# EAGLE board WheresThePartyAt (EAGLE 5.10)
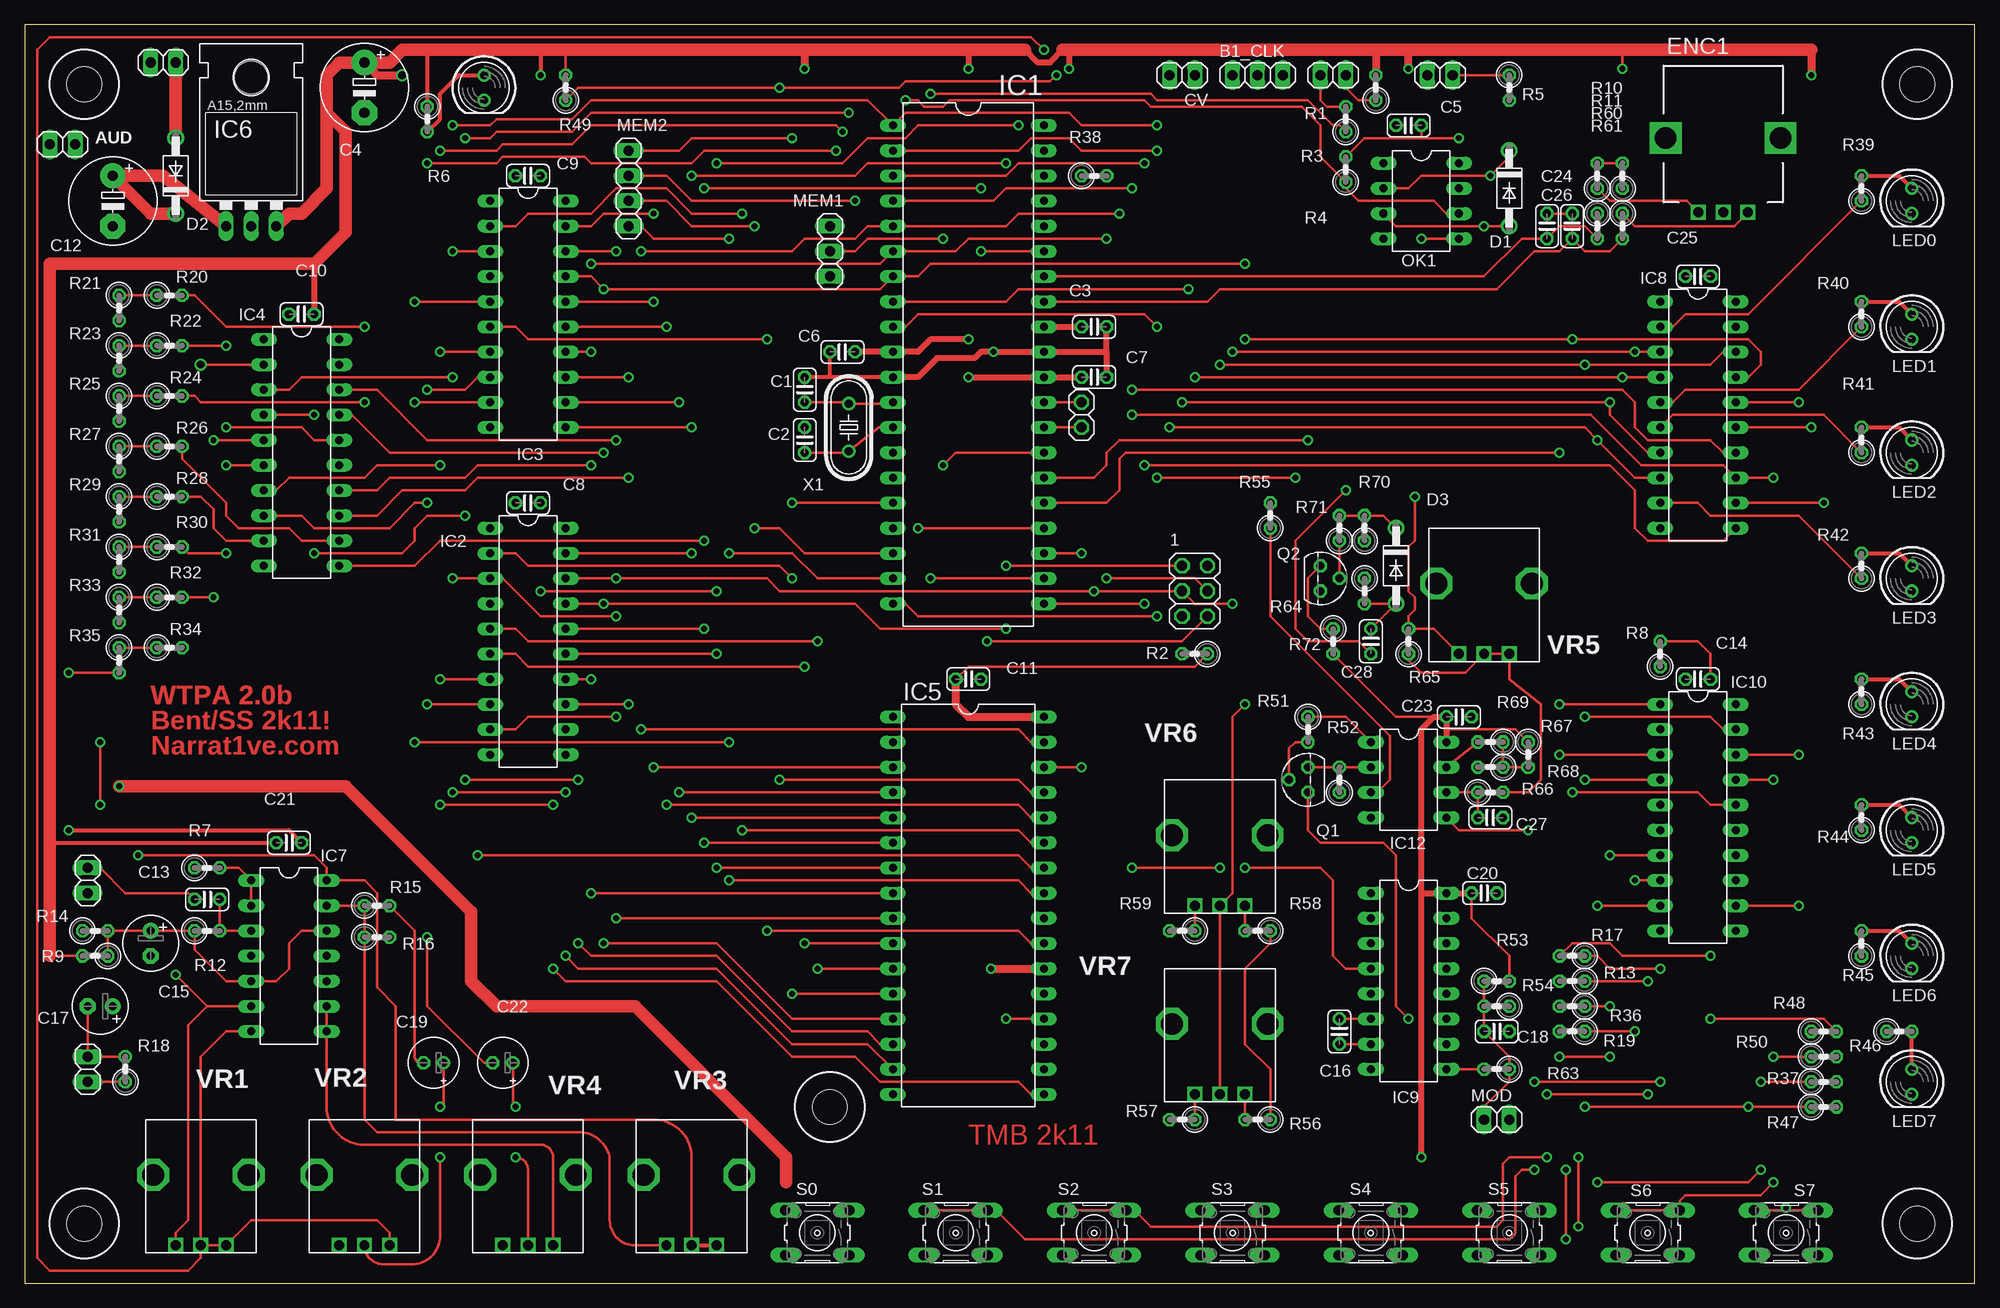
[diagram p4: board, top side]
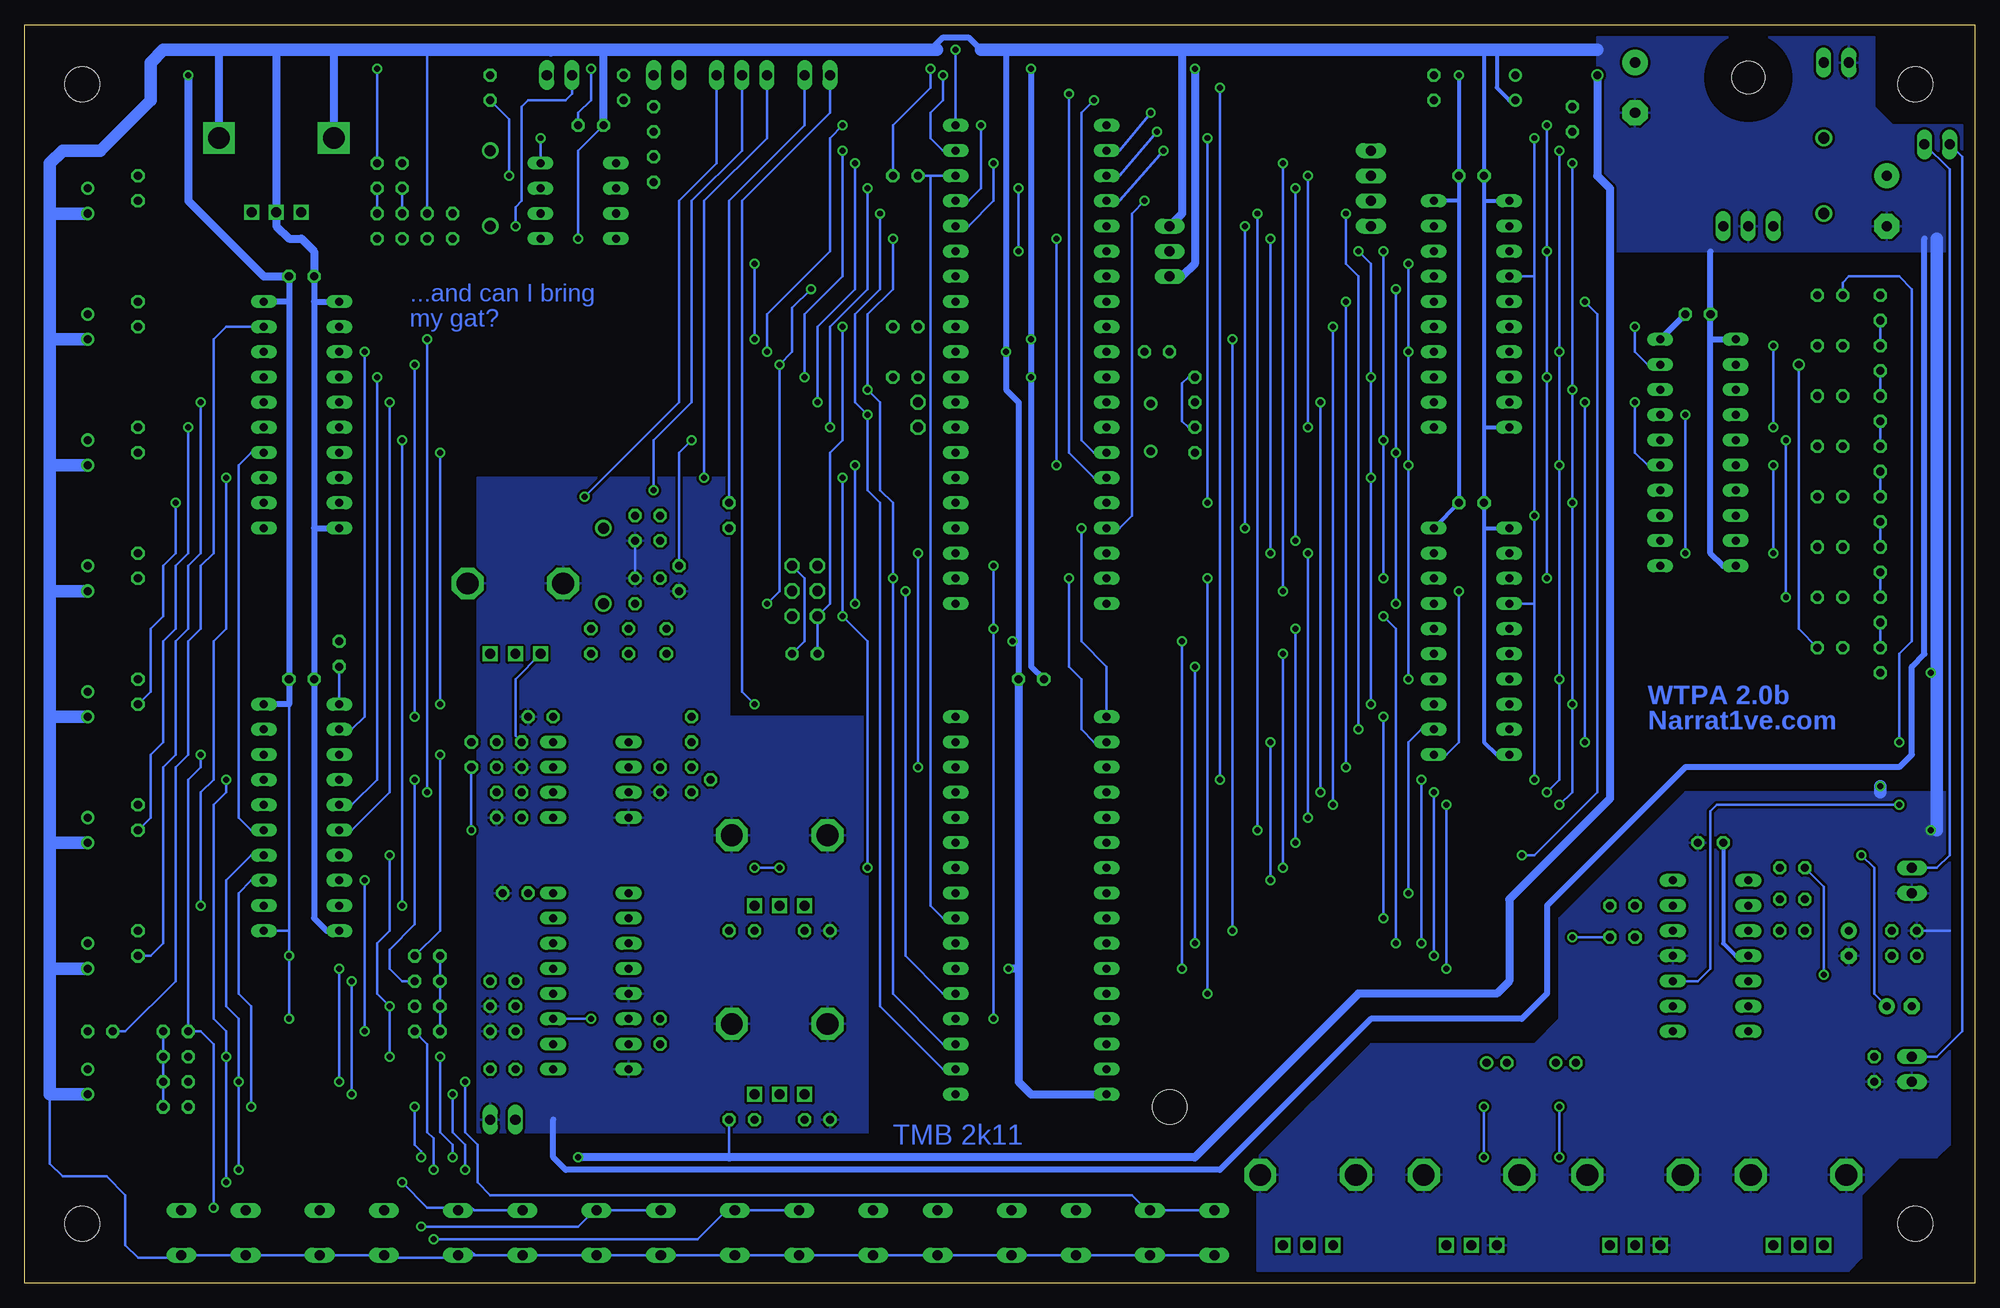
[diagram p5: board, bottom side, seen from below]

Size 196.85 x 127 mm. Coordinates in mm from the lower left corner, seen from the top.
Outline: 0,0 196.85,0 196.85,127 0,127 0,0
Copper layers (1+16): Top 0.035mm / dielectric 1.5mm / Bottom 0.035mm
Design rules "default *": minimum track width 8mil, minimum drill 19mil, track to track 8mil, track to pad 8mil, pad to pad 8mil, via to via 8mil, smd to smd 0mil, copper to edge 20mil, drill to drill 8mil, minimum pad ring 10mil, minimum via ring 8mil, stop-mask expansion 4mil, vias tented up to drill 0mil, thermal gap 10mil

## Footprints (pad centres in the part's own frame; a part is rotated, then mirrored left to right if it is on the bottom)
1X02 = drill 1.016 long: 1 -1.27,0; 2 1.27,0
1X03 = drill 1.016 long: 1 -2.54,0; 2 0,0; 3 2.54,0
C025-024X044 = drill 0.813 octagon: 1 -1.27,0; 2 1.27,0
E5-8,5 = drill 1.016 pad 2.54 round: + -2.54,0 | drill 1.016 pad 2.54 octagon: - 2.54,0
E2,5-6 = drill 0.813 pad 1.6 round: + -1.27,0 | drill 0.813 pad 1.6 octagon: - 1.27,0
E2-5 = drill 0.813 pad 1.27 round: + -1.016,0 | drill 0.813 pad 1.27 octagon: - 1.016,0
DO41-762 = drill 1.118 round: A 3.81,0; C -3.81,0
RE111F_40_ENC = drill 1 square: A -2.5,-7.5; B 2.5,-7.5; COM 0,-7.5 | drill 2.2 square: MNT1 -5.8,0; MNT2 5.8,0
DIL40 = drill 0.813 long: 1 -24.13,-7.62; 2 -21.59,-7.62; 3 -19.05,-7.62; 4 -16.51,-7.62; 5 -13.97,-7.62; 6 -11.43,-7.62; 7 -8.89,-7.62; 8 -6.35,-7.62; 9 -3.81,-7.62; 10 -1.27,-7.62; 11 1.27,-7.62; 12 3.81,-7.62; 13 6.35,-7.62; 14 8.89,-7.62; 15 11.43,-7.62; 16 13.97,-7.62; 17 16.51,-7.62; 18 19.05,-7.62; 19 21.59,-7.62; 20 24.13,-7.62; 21 24.13,7.62; 22 21.59,7.62; 23 19.05,7.62; 24 16.51,7.62; 25 13.97,7.62; 26 11.43,7.62; 27 8.89,7.62; 28 6.35,7.62; 29 3.81,7.62; 30 1.27,7.62; 31 -1.27,7.62; 32 -3.81,7.62; 33 -6.35,7.62; 34 -8.89,7.62; 35 -11.43,7.62; 36 -13.97,7.62; 37 -16.51,7.62; 38 -19.05,7.62; 39 -21.59,7.62; 40 -24.13,7.62
DIL20 = drill 0.813 long: 1 -11.43,-3.81; 2 -8.89,-3.81; 3 -6.35,-3.81; 4 -3.81,-3.81; 5 -1.27,-3.81; 6 1.27,-3.81; 7 3.81,-3.81; 8 6.35,-3.81; 9 8.89,-3.81; 10 11.43,-3.81; 11 11.43,3.81; 12 8.89,3.81; 13 6.35,3.81; 14 3.81,3.81; 15 1.27,3.81; 16 -1.27,3.81; 17 -3.81,3.81; 18 -6.35,3.81; 19 -8.89,3.81; 20 -11.43,3.81
DIL32 = drill 0.813 long: 1 -19.05,-7.62; 2 -16.51,-7.62; 3 -13.97,-7.62; 4 -11.43,-7.62; 5 -8.89,-7.62; 6 -6.35,-7.62; 7 -3.81,-7.62; 8 -1.27,-7.62; 9 1.27,-7.62; 10 3.81,-7.62; 11 6.35,-7.62; 12 8.89,-7.62; 13 11.43,-7.62; 14 13.97,-7.62; 15 16.51,-7.62; 16 19.05,-7.62; 17 19.05,7.62; 18 16.51,7.62; 19 13.97,7.62; 20 11.43,7.62; 21 8.89,7.62; 22 6.35,7.62; 23 3.81,7.62; 24 1.27,7.62; 25 -1.27,7.62; 26 -3.81,7.62; 27 -6.35,7.62; 28 -8.89,7.62; 29 -11.43,7.62; 30 -13.97,7.62; 31 -16.51,7.62; 32 -19.05,7.62
78XXL = drill 1.016 long: GND 0,-3.81; IN -2.54,-3.81; OUT 2.54,-3.81 | hole 3.302: 0,11.176
DIL14 = drill 0.813 long: 1 -7.62,-3.81; 2 -5.08,-3.81; 3 -2.54,-3.81; 4 0,-3.81; 5 2.54,-3.81; 6 5.08,-3.81; 7 7.62,-3.81; 8 7.62,3.81; 9 5.08,3.81; 10 2.54,3.81; 11 0,3.81; 12 -2.54,3.81; 13 -5.08,3.81; 14 -7.62,3.81
DIL16 = drill 0.813 long: 1 -8.89,-3.81; 2 -6.35,-3.81; 3 -3.81,-3.81; 4 -1.27,-3.81; 5 1.27,-3.81; 6 3.81,-3.81; 7 6.35,-3.81; 8 8.89,-3.81; 9 8.89,3.81; 10 6.35,3.81; 11 3.81,3.81; 12 1.27,3.81; 13 -1.27,3.81; 14 -3.81,3.81; 15 -6.35,3.81; 16 -8.89,3.81
DIL08 = drill 0.813 long: 1 -3.81,-3.81; 2 -1.27,-3.81; 3 1.27,-3.81; 4 3.81,-3.81; 5 3.81,3.81; 6 1.27,3.81; 7 -1.27,3.81; 8 -3.81,3.81
1X01 = drill 1.016 octagon: 1 0,0
2X03 = drill 1.016 octagon: 1 -2.54,-1.27; 2 -2.54,1.27; 3 0,-1.27; 4 0,1.27; 5 2.54,-1.27; 6 2.54,1.27
LED5MM = drill 0.813 round: A -1.27,0; K 1.27,0
1X04 = drill 1.016 long: 1 -3.81,0; 2 -1.27,0; 3 1.27,0; 4 3.81,0
TO92 = drill 0.813 octagon: 1 1.27,0; 2 0,1.905; 3 -1.27,0
0207/2V = drill 0.813 octagon: 1 -1.27,0; 2 1.27,0
B3F-10XX = drill 1.016 long: 1 -3.251,2.261; 2 3.251,2.261; 3 -3.251,-2.261; 4 3.251,-2.261
6X32_HOLE = hole 3.5: 0,0
ALPHA_9MM_POT = drill 1 square: P$1 -2.54,-7.62; P$2 0,-7.62; P$3 2.54,-7.62 | drill 2.2 octagon: P$4 -4.826,-0.508; P$5 4.826,-0.508
HC49U-V = drill 0.813 round: 1 -2.413,0; 2 2.413,0

## Placement (x,y rotation side)
AUD  [1X02]  3.81,114.94 180 top
B1_CLK  [1X03]  124.46,121.92 0 top
C1  20pF  [C025-024X044]  78.74,90.17 90 top
C2  20pF  [C025-024X044]  78.74,85.09 90 top
C3  0.1uF  [C025-024X044]  107.95,96.52 0 top
C4  330uF  [E5-8,5]  34.29,120.65 270 top
C5  0.1uF  [C025-024X044]  139.7,116.84 180 top
C6  0.1uF  [C025-024X044]  82.55,93.98 180 top
C7  0.1uF  [C025-024X044]  107.95,91.44 0 top
C8  0.1uF  [C025-024X044]  50.8,78.74 180 top
C9  0.1uF  [C025-024X044]  50.8,111.76 180 top
C10  0.1uF  [C025-024X044]  27.94,97.79 180 top
C11  0.1uF  [C025-024X044]  95.25,60.96 0 top
C12  100uF  [E5-8,5]  8.89,109.22 270 top
C13  0.1uF  [C025-024X044]  18.41,38.73 0 top
C14  0.1uF  [C025-024X044]  168.91,60.96 180 top
C15  10uF  [E2,5-6]  12.7,34.29 270 top
C16  0.1uF  [C025-024X044]  132.72,25.4 90 top
C17  10uF  [E2,5-6]  7.62,27.94 180 top
C18  0.1uF  [C025-024X044]  148.59,25.4 0 top
C19  1.0uF  [E2-5]  41.27,22.23 180 top
C20  0.1uF  [C025-024X044]  147.32,39.37 0 top
C21  0.1uF  [C025-024X044]  26.67,44.45 0 top
C22  1.0uF  [E2-5]  48.26,22.23 180 top
C23  0.1uF  [C025-024X044]  144.78,57.15 0 top
C24  0.1uF  [C025-024X044]  156.21,106.68 90 top
C25  0.1uF  [C025-024X044]  168.91,101.6 180 top
C26  0.1uF  [C025-024X044]  153.67,106.68 90 top
C27  0.1uF  [C025-024X044]  147.96,46.99 180 top
C28  820pF  [C025-024X044]  135.89,64.77 270 top
CV  [1X02]  116.84,121.92 180 top
D1  1N4004  [DO41-762]  149.86,110.49 270 top
D2  1N4004  [DO41-762]  15.24,111.76 90 top
D3  1N4004  [DO41-762]  138.43,72.39 270 top
ENC1  [RE111F_40_ENC]  171.45,115.57 0 top
IC1  ATMEGA644pa  [DIL40]  95.25,92.71 270 top
IC2  74LS373N  [DIL20]  50.8,64.77 270 top
IC3  74LS373N  [DIL20]  50.8,97.79 270 top
IC4  74LS373N  [DIL20]  27.94,83.82 270 top
IC5  AS6C4008  [DIL32]  95.25,38.1 270 top
IC6  [78XXL]  22.86,110.49 0 top
IC7  TLV2474  [DIL14]  26.67,33.02 270 top
IC8  74LS373N  [DIL20]  168.91,87.63 270 top
IC9  4046N  [DIL16]  139.7,30.48 270 top
IC10  74LS373N  [DIL20]  168.91,46.99 270 top
IC12  LM358  [DIL08]  139.7,50.8 270 top
JP1  [1X01]  106.68,88.9 0 top
JP2  [1X01]  106.68,86.36 0 top
JP3  ISP  [2X03]  118.11,69.85 270 top
JP5  DC In  [1X02]  13.97,123.19 0 top
JP6  AudioIn  [1X02]  6.35,40.64 90 top
JP7  AudioOut  [1X02]  6.35,21.59 270 top
JP10  MIDI Out  [1X02]  132.08,121.92 0 top
JP11  MIDI In  [1X02]  142.88,121.92 0 top
LED0  [LED5MM]  190.5,109.22 270 top
LED1  [LED5MM]  190.5,96.52 270 top
LED2  [LED5MM]  190.5,83.82 270 top
LED3  [LED5MM]  190.5,71.12 270 top
LED4  [LED5MM]  190.5,58.42 270 top
LED5  [LED5MM]  190.5,45.72 270 top
LED6  [LED5MM]  190.5,33.02 270 top
LED7  [LED5MM]  190.5,20.32 270 top
MEM1  [1X03]  81.28,104.14 90 top
MEM2  [1X04]  60.96,110.49 90 top
MOD  [1X02]  148.59,16.51 0 top
OK1  6N138  [DIL08]  140.97,109.22 270 top
POWER  [LED5MM]  46.35,120.65 270 top
Q1  BC337  [TO92]  129.54,50.8 90 top
Q2  BC337  [TO92]  130.81,71.12 270 top
R1  220  [0207/2V]  136.4,120.65 90 top
R2  10k  [0207/2V]  118.11,63.5 180 top
R3  220  [0207/2V]  133.35,117.47 90 top
R4  220  [0207/2V]  133.35,112.39 90 top
R5  220  [0207/2V]  149.86,120.65 270 top
R6  220  [0207/2V]  40.64,117.47 270 top
R7  2.2k  [0207/2V]  18.41,41.91 0 top
R8  10k  [0207/2V]  165.1,63.5 90 top
R9  10k  [0207/2V]  7.11,33.02 180 top
R10  10k  [0207/2V]  158.75,111.76 90 top
R11  10k  [0207/2V]  161.29,111.76 90 top
R12  200k  [0207/2V]  18.41,35.56 0 top
R13  10k  [0207/2V]  156.21,30.48 180 top
R14  10k  [0207/2V]  7.11,35.56 0 top
R15  200k  [0207/2V]  35.56,38.1 0 top
R16  200k  [0207/2V]  35.56,34.92 0 top
R17  10k  [0207/2V]  156.21,33.02 180 top
R18  200k  [0207/2V]  10.16,21.59 90 top
R19  10k  [0207/2V]  156.21,25.4 180 top
R20  51k  [0207/2V]  14.61,99.69 0 top
R21  25.5k  [0207/2V]  9.53,98.42 270 top
R22  51k  [0207/2V]  14.61,94.61 0 top
R23  25.5k  [0207/2V]  9.53,93.34 270 top
R24  51k  [0207/2V]  14.61,89.53 0 top
R25  25.5k  [0207/2V]  9.53,88.27 270 top
R26  51k  [0207/2V]  14.61,84.45 0 top
R27  25.5k  [0207/2V]  9.53,83.19 270 top
R28  51k  [0207/2V]  14.61,79.38 0 top
R29  25.5k  [0207/2V]  9.53,78.11 270 top
R30  51k  [0207/2V]  14.61,74.3 0 top
R31  25.5k  [0207/2V]  9.53,73.03 270 top
R32  51k  [0207/2V]  14.61,69.22 0 top
R33  25.5k  [0207/2V]  9.53,67.94 270 top
R34  51k  [0207/2V]  14.61,64.14 0 top
R35  51k  [0207/2V]  9.53,62.87 270 top
R36  10k  [0207/2V]  156.21,27.94 180 top
R37  10k  [0207/2V]  181.61,20.32 0 top
R38  200k  [0207/2V]  107.95,111.76 0 top
R39  470  [0207/2V]  185.42,110.49 90 top
R40  470  [0207/2V]  185.42,97.79 90 top
R41  470  [0207/2V]  185.42,85.09 90 top
R42  470  [0207/2V]  185.42,72.39 90 top
R43  470  [0207/2V]  185.42,59.69 90 top
R44  470  [0207/2V]  185.42,46.99 90 top
R45  470  [0207/2V]  185.42,34.29 90 top
R46  470  [0207/2V]  189.23,25.4 0 top
R47  10k  [0207/2V]  181.61,17.78 0 top
R48  10k  [0207/2V]  181.61,25.4 0 top
R49  200k  [0207/2V]  54.61,120.65 90 top
R50  10k  [0207/2V]  181.61,22.86 0 top
R51  470  [0207/2V]  129.54,55.88 270 top
R52  2.2k  [0207/2V]  132.72,50.8 90 top
R53  10k  [0207/2V]  148.59,30.48 0 top
R54  10k  [0207/2V]  148.59,27.94 180 top
R55  470  [0207/2V]  125.73,77.47 90 top
R56  51k  [0207/2V]  124.46,16.51 180 top
R57  51k  [0207/2V]  116.84,16.51 180 top
R58  14.3k  [0207/2V]  124.46,35.56 180 top
R59  220  [0207/2V]  116.84,35.56 180 top
R60  10k  [0207/2V]  158.75,106.68 270 top
R61  10k  [0207/2V]  161.29,106.68 270 top
R63  10k  [0207/2V]  148.59,21.59 180 top
R64  10k  [0207/2V]  135.25,69.85 270 top
R65  10k  [0207/2V]  139.7,64.77 90 top
R66  220  [0207/2V]  147.96,49.53 0 top
R67  10k  [0207/2V]  151.76,53.34 270 top
R68  10k  [0207/2V]  147.96,52.07 180 top
R69  10k  [0207/2V]  147.96,54.61 180 top
R70  10k  [0207/2V]  135.25,76.2 90 top
R71  470  [0207/2V]  132.72,76.2 90 top
R72  2.2k  [0207/2V]  132.08,64.77 270 top
S0  [B3F-10XX]  80.01,5.08 180 top
S1  [B3F-10XX]  93.98,5.08 180 top
S2  [B3F-10XX]  107.95,5.08 180 top
S3  [B3F-10XX]  121.92,5.08 180 top
S4  [B3F-10XX]  135.89,5.08 180 top
S5  [B3F-10XX]  149.86,5.08 180 top
S6  [B3F-10XX]  163.83,5.08 180 top
S7  [B3F-10XX]  177.8,5.08 180 top
U$1  [6X32_HOLE]  6,6 0 top
U$2  [6X32_HOLE]  191.05,6 0 top
U$3  [6X32_HOLE]  191.05,121 0 top
U$4  [6X32_HOLE]  6,121 0 top
U$5  [6X32_HOLE]  81.28,17.78 0 top
VR1  100kA  [ALPHA_9MM_POT]  17.78,11.43 0 top
VR2  10kA  [ALPHA_9MM_POT]  34.29,11.43 0 top
VR3  100kA  [ALPHA_9MM_POT]  67.31,11.43 0 top
VR4  10kA  [ALPHA_9MM_POT]  50.8,11.43 0 top
VR5  10kA  [ALPHA_9MM_POT]  147.32,71.12 0 top
VR6  10kA  [ALPHA_9MM_POT]  120.65,45.72 0 top
VR7  100kA  [ALPHA_9MM_POT]  120.65,26.67 0 top
X1  [HC49U-V]  83.19,86.36 90 top

## Tracks (layer width: path | path; a pad name or v marks a point on that pad's centre or on a via)
A0  (via drill 0.6)
  Top 0.254: IC2.2 49.53,73.66 50.8,72.39 76.2,72.39 v77.47,71.12 | v77.47,29.21 IC5.12
  Bottom 0.254: v77.47,29.21 v77.47,71.12
A1  (via drill 0.6)
  Top 0.254: IC2.5 49.53,66.04 50.8,64.77 v80.01,64.77 | v80.01,31.75 IC5.11
  Bottom 0.254: v80.01,64.77 80.01,59.69 v80.01,31.75
A2  (via drill 0.6)
  Top 0.254: IC2.6 49.53,63.5 50.8,62.23 v78.74,62.23 | v78.74,34.29 IC5.10
  Bottom 0.254: v78.74,62.23 78.74,58.42 v78.74,34.29
A3  (via drill 0.6)
  Top 0.254: IC2.9 49.53,55.88 50.8,57.15 v59.69,57.15 | v59.69,36.83 IC5.9
  Bottom 0.254: v59.69,36.83 v59.69,57.15
A4  (via drill 0.6)
  Top 0.254: v57.15,39.37 IC5.8
  Bottom 0.254: v57.15,39.37 57.15,54.61 55.88,55.88 IC2.12
A5  (via drill 0.6)
  Top 0.254: v69.85,63.5 IC2.15 | v69.85,41.91 IC5.7
  Bottom 0.254: v69.85,41.91 v69.85,63.5
A6  (via drill 0.6)
  Top 0.254: v68.58,66.04 IC2.16 | v68.58,44.45 IC5.6
  Bottom 0.254: v68.58,44.45 v68.58,66.04
A7  (via drill 0.6)
  Top 0.254: v67.31,73.66 IC2.19 | v67.31,46.99 IC5.5
  Bottom 0.254: v67.31,46.99 v67.31,73.66
A8  (via drill 0.6)
  Top 0.254: IC3.2 49.53,106.68 50.8,107.95 57.15,107.95 59.69,110.49 64.77,110.49 67.31,107.95 v72.39,107.95 | IC5.27 101.6,44.45 100.33,45.72 v72.39,45.72
  Bottom 0.254: v72.39,45.72 v72.39,107.95
A9  (via drill 0.6)
  Top 0.254: IC5.26 101.6,41.91 100.33,43.18 v45.72,43.18 | v39.37,99.06 IC3.5
  Bottom 0.254: v39.37,99.06 38.1,97.79 38.1,49.53 44.45,43.18 v45.72,43.18
A10  (via drill 0.6)
  Top 0.254: IC3.6 49.53,96.52 50.8,95.25 v74.93,95.25 | IC5.23 101.6,34.29 100.33,35.56 v74.93,35.56
  Bottom 0.254: v74.93,35.56 v74.93,95.25
A11  (via drill 0.6)
  Top 0.254: IC5.25 101.6,39.37 100.33,40.64 v71.12,40.64 | v39.37,88.9 IC3.9 | v39.37,54.61 v71.12,54.61
  Bottom 0.254: v71.12,54.61 v71.12,40.64 | v39.37,54.61 v39.37,88.9
A12  (via drill 0.6)
  Top 0.254: v66.04,88.9 IC3.12 | v66.04,49.53 IC5.4
  Bottom 0.254: v66.04,49.53 v66.04,88.9
A13  (via drill 0.6)
  Top 0.254: v64.77,96.52 IC3.15 | IC5.28 101.6,46.99 100.33,48.26 v64.77,48.26
  Bottom 0.254: v64.77,48.26 v64.77,96.52
A14  (via drill 0.6)
  Top 0.254: v63.5,99.06 IC3.16 | v63.5,52.07 IC5.3
  Bottom 0.254: v63.5,52.07 v63.5,99.06
A15  (via drill 0.6)
  Top 0.254: IC3.19 57.15,106.68 58.42,107.95 v63.5,107.95 | IC5.31 101.6,54.61 100.33,55.88 v62.23,55.88
  Bottom 0.254: v62.23,55.88 62.23,101.6 63.5,102.87 v63.5,107.95
A16  (via drill 0.6)
  Top 0.254: v91.44,71.12 IC1.22
  Bottom 0.254: v91.44,71.12 91.44,62.23 90.17,60.96 90.17,55.88 88.9,54.61 IC5.2
A17  (via drill 0.6)
  Top 0.254: v106.68,73.66 IC1.23 | IC5.30 v106.68,52.07
  Bottom 0.254: v106.68,52.07 v106.68,73.66
A18  (via drill 0.6)
  Top 0.254: v90.17,76.2 IC1.24
  Bottom 0.254: v90.17,76.2 90.17,64.77 87.63,62.23 IC5.1
ACLK  (via drill 0.6)
  Top 0.254: IC1.20 88.9,68.58 90.17,67.31 v114.3,67.31 | IC9.4 133.35,31.75 132.08,33.02 132.08,40.64 130.81,41.91 v123.19,41.91 | v111.76,41.91 v120.65,41.91 | v114.3,81.28 v128.27,81.28
  Bottom 0.254: v120.65,41.91 v123.19,41.91 | v111.76,41.91 111.76,64.77 v114.3,67.31 v114.3,81.28 | v128.27,81.28 128.27,109.22 121.92,115.57 B1_CLK.1
AIN0  (via drill 0.6)
  Top 0.254: VR1.P$2 VR1.P$3 22.86,6.35 35.56,6.35 36.83,5.08 VR2.P$3 | VR1.P$2 17.78,22.86 20.32,25.4 IC7.7 | v102.87,124.46 101.6,125.73 2.54,125.73 1.27,124.46 1.27,2.54 2.54,1.27 16.51,1.27 17.78,2.54 VR1.P$2
  Bottom 0.254: v102.87,124.46 IC1.40
AUDIO_IN
  Top 0.254: JP6.2 7.62,41.91 10.16,39.37 16.51,39.37 C13.1
  Bottom 0.254: JP6.2 3.81,41.91 2.54,43.18 2.54,112.39 AUD.1
AUDIO_OUT
  Top 0.254: R18.2 JP7.1 C17.-
  Bottom 0.254: AUD.2 1.27,113.67 1.27,25.4 3.81,22.86 JP7.1
BCLK  (via drill 0.6)
  Top 0.254: Q2.3 129.54,71.12 129.54,67.31 130.81,66.04 R72.1 | IC1.26 107.95,81.28 109.22,82.55 109.22,83.82 110.49,85.09 v129.54,85.09
  Bottom 0.254: v129.54,85.09 130.81,83.82 Q2.3
CV_IN
  Top 0.254: R55.1 125.73,67.31 137.79,55.24 137.79,50.8 136.53,49.53 IC12.3
CV_KNOB  (via drill 0.6)
  Top 0.254: VR7.P$2 VR6.P$2 121.92,39.37 121.92,57.15 v123.19,58.42
  Bottom 0.254: CV.2 115.57,118.11 124.46,109.22 124.46,59.69 v123.19,58.42
DAC
  Top 0.254: IC7.9 IC7.8 30.48,17.78 arc90 34.29,13.97 52.07,13.97 arc-90 53.34,12.7 VR4.P$3
DAC0  (via drill 0.8)
  Top 0.254: v17.78,92.71 IC4.2
  Bottom 0.254: v17.78,92.71 17.78,66.04 R34.2
DAC1  (via drill 0.6)
  Top 0.254: v19.05,85.09 IC4.5 | R32.2 v19.05,69.22
  Bottom 0.254: v19.05,69.22 v19.05,85.09
DAC2  (via drill 0.6)
  Top 0.254: v20.32,82.55 IC4.6 | v20.32,73.66 16.51,73.66 R30.2
  Bottom 0.254: v20.32,73.66 v20.32,82.55
DAC3
  Top 0.254: IC4.9 20.32,74.93 19.05,76.2 19.05,78.11 17.78,79.38 R28.2
DAC4
  Top 0.254: R26.2 15.88,83.19 20.32,78.74 20.32,77.47 21.59,76.2 26.67,76.2 27.94,74.93 IC4.12
DAC5  (via drill 0.6)
  Top 0.254: R24.2 17.14,89.53 17.78,88.9 v34.29,88.9
  Bottom 0.254: v34.29,88.9 34.29,83.82 33.02,82.55 IC4.15
DAC6  (via drill 0.6)
  Top 0.254: IC4.16 29.21,85.09 27.94,86.36 v20.32,86.36 | v20.32,94.61 R22.2
  Bottom 0.254: v20.32,86.36 v20.32,94.61
DAC7  (via drill 0.6)
  Top 0.254: R20.2 17.14,99.69 20.32,96.52 v34.29,96.52
  Bottom 0.254: v34.29,96.52 34.29,93.98 33.02,92.71 IC4.19
DAC_O  (via drill 0.6)
  Top 0.254: v40.64,34.92 40.64,27.94 46.35,22.23 C22.-
  Bottom 0.254: v40.64,34.92 R16.2
ENC_A
  Top 0.254: IC1.34 147.32,101.6 151.13,105.41 C26.1 154.94,106.68 157.48,106.68 R60.2
ENC_B
  Top 0.254: IC1.33 119.38,99.06 120.65,100.33 148.59,100.33 152.4,104.14 154.94,104.14 C24.1 157.48,104.14 160.02,104.14 R61.2
GND  (via drill 0.6)
  Top 0.254: v4.45,61.59 R35.2 | JP7.2 R18.1 | v140.97,105.41 OK1.5 | C24.2 C26.2 | JP3.6 116.84,64.77 v97.16,64.77
  Top 0.406: IC1.11 81.28,91.44 | 81.28,91.44 C1.2 | 81.28,91.44 C6.2 | v4.45,45.72 26.67,45.72 C21.2
  Top 0.61: 109.22,93.98 IC1.31 v97.79,93.98 96.52,93.98 95.89,93.34 92.08,93.34 90.17,91.44 IC1.11 | 109.22,93.98 C3.2 | 109.22,93.98 C7.2
  Top 0.813: v97.54,31.75 IC5.22
  Top 1.27: v9.53,50.16 32.38,50.16 45.09,37.47 45.09,30.48 47.62,27.94 61.59,27.94 76.83,12.7 76.83,10.16
  Bottom 0.254: 3.81,61.59 v4.45,61.59 | S0.2 82.91,2.82 83.19,2.54 83.26,2.62 S0.1 S1.2 S1.1 104.5,2.82 104.7,2.62 | 104.7,2.62 104.78,2.54 | 104.7,2.62 S2.2 110.85,2.82 111.12,2.54 111.2,2.62 S2.1 118.47,2.82 118.67,2.62 | 118.67,2.62 118.75,2.54 | 118.67,2.62 S3.2 124.82,2.82 125.09,2.54 125.17,2.62 S3.1 132.44,2.82 132.64,2.62 | 145.34,2.62 145.41,2.54 | 145.34,2.62 S5.2 151.41,2.82 | 145.34,2.62 145.14,2.82 S4.1 139.14,2.62 139.06,2.54 138.79,2.82 S4.2 132.64,2.62 | 151.41,2.82 151.76,3.17 151.84,3.1 S5.1 151.84,2.62 | 152.04,2.82 152.12,2.82 152.4,2.54 160.02,2.54 160.3,2.82 S6.2 160.58,2.62 160.66,2.54 160.93,2.82 S6.1 174.35,2.82 174.55,2.62 | 194.31,19.05 194.31,12.06 193.04,10.79 188.59,10.79 186.69,8.89 186.69,3.81 185.42,2.54 180.97,2.54 181.05,2.62 S7.1 174.9,2.82 174.62,2.54 174.55,2.62 | 132.64,2.62 132.72,2.54 | 151.84,2.62 151.76,2.54 | 152.04,2.82 151.41,2.82 | 152.04,2.82 151.84,2.62 | 2.54,35.56 R14.1 | C5.2 140.97,114.3 v140.97,105.41 | 174.55,2.62 S7.2 | 165.1,124.46 165.65,124.46 | 177.8,124.46 177.25,124.46 | 156.21,124.46 C24.2 | R64.1 R70.1 | 96.52,64.77 v97.16,64.77 | C2.2 79.38,86.36 80.01,87 80.01,90.81 79.38,91.44 C1.2
  Bottom 0.406: 49.53,109.22 C9.2 49.53,124.46 | 49.53,109.22 49.53,86.36 | 49.53,86.36 C8.2 49.53,76.2 | 49.53,109.22 IC3.1 | 49.53,76.2 IC2.1 | 49.53,86.36 IC3.10 | IC2.10 48.26,53.34 49.53,54.61 49.53,76.2 | POWER.K 46.99,119.38 48.26,120.65 48.26,124.46 | v4.45,45.72 3.81,45.72
  Bottom 0.61: 26.67,95.25 C10.2 26.67,104.14 | 26.67,95.25 IC4.1 | IC4.10 25.4,72.39 26.67,73.66 26.67,95.25 | C25.2 167.64,99.06 | 167.64,99.06 IC8.1 | 167.64,76.2 IC8.10 | 167.64,99.06 167.64,76.2 | 167.64,76.2 C14.2 167.64,36.83 166.37,35.56 IC10.10 | C11.2 96.52,64.77 96.52,88.9 97.79,90.17 v97.79,93.98 97.79,124.46 | 5.08,105.41 5.08,63.5 6.35,62.23 6.35,53.34 7.62,52.07 29.21,52.07 43.18,38.1 43.18,29.21 45.72,26.67 60.96,26.67 76.2,11.43 142.24,11.43 143.51,12.7 143.51,16.51 | 100.33,124.46 101.6,125.73 104.14,125.73 105.41,124.46
  Bottom 0.813: 143.51,124.46 143.76,124.21 | C25.2 167.64,104.14 168.91,105.41 170.18,105.41 171.45,106.68 ENC1.COM 171.45,124.46 | IC5.16 95.25,19.05 96.52,20.32 96.52,31.75 | C11.2 96.52,31.75 | 165.65,124.46 ENC1.MNT1 | 177.25,124.46 ENC1.MNT2 | C5.2 138.43,124.46 | MEM1.3 80.01,107.95 80.01,124.46 | 96.52,31.75 v97.54,31.75
  Bottom 1.27: 100.33,124.46 97.79,124.46 80.01,124.46 49.53,124.46 48.26,124.46 38.1,124.46 | 104.78,124.46 105.41,124.46 138.43,124.46 143.51,124.46 156.21,124.46 165.1,124.46 171.45,124.46 177.8,124.46 182.88,124.46 184.15,123.19 184.15,119.38 189.23,114.3 193.04,114.3 194.31,113.03 194.31,107.95 | 3.81,105.41 3.81,61.59 3.81,45.72 | 194.31,107.95 LED0.K | LED7.K 194.31,19.05 194.31,31.75 | 194.31,107.95 194.31,95.25 | 194.31,95.25 194.31,82.55 | 194.31,82.55 194.31,69.85 | 194.31,69.85 194.31,57.15 | 194.31,57.15 194.31,44.45 | 194.31,44.45 194.31,31.75 | 194.31,95.25 LED1.K | 194.31,82.55 LED2.K | 194.31,69.85 LED3.K | 194.31,57.15 LED4.K | 194.31,44.45 LED5.K | 194.31,31.75 LED6.K | v9.53,50.16 9.53,49.53
  pour Bottom (isolate 0.254): 2.54,49.53 29.21,49.53 41.91,36.83 41.91,26.67 44.45,24.13 60.96,24.13 72.39,12.7 72.39,1.27 12.7,1.27 11.43,2.54 11.43,8.89 7.62,12.7 3.81,12.7 2.54,13.97
  pour Bottom (isolate 0.254): 111.76,57.15 125.73,57.15 125.73,81.28 151.13,81.28 151.13,15.24 111.76,15.24
  pour Bottom (isolate 0.254): 10.16,125.73 10.16,118.75 8.26,116.84 1.27,116.84 1.27,104.14 38.1,104.14 38.1,125.73
LATCH0  (via drill 0.6)
  Top 0.254: v43.18,116.84 46.99,116.84 47.62,117.47 55.24,117.47 57.15,119.38 85.09,119.38 IC1.1 88.9,118.11 105.41,118.11 106.68,116.84 v114.3,116.84 | v43.18,104.14 IC3.3 | v43.18,71.12 IC2.3 48.26,71.12 52.07,67.31 v59.69,67.31 | IC4.3 26.67,90.17 27.94,91.44 v43.18,91.44 | IC8.3 v162.56,93.98 v121.92,93.98 | IC5.13 77.47,26.67 69.85,34.29 v58.42,34.29
  Bottom 0.254: v43.18,116.84 v43.18,104.14 v43.18,91.44 v43.18,71.12 | v114.3,116.84 115.57,115.57 115.57,104.14 121.92,97.79 v121.92,93.98 | v59.69,67.31 58.42,66.04 v58.42,34.29 | IC10.2 163.83,55.88 162.56,57.15 v162.56,93.98
LATCH1  (via drill 0.6)
  Top 0.254: v44.45,115.57 46.99,115.57 47.62,116.2 55.24,116.2 57.15,118.11 v83.19,118.11 | v29.21,87.63 IC4.4 | v29.21,73.66 38.1,73.66 39.37,74.93 39.37,76.2 40.64,77.47 v44.45,77.47 | v114.3,114.3 106.68,114.3 105.41,115.57 101.6,115.57 100.33,114.3 IC1.2 | IC8.4 v161.29,91.44 v118.11,91.44 | IC5.14 86.36,24.13 85.09,25.4 77.47,25.4 69.85,33.02 57.15,33.02 v55.88,34.29 | v44.45,50.8 v55.88,50.8
  Bottom 0.254: IC1.2 86.36,114.3 v83.19,118.11 | v44.45,115.57 44.45,101.6 | 44.45,101.6 IC3.4 | 44.45,68.58 v44.45,77.47 44.45,101.6 | v29.21,73.66 v29.21,87.63 | v114.3,114.3 114.3,101.6 118.11,97.79 v118.11,91.44 | 44.45,68.58 IC2.4 | 44.45,68.58 v44.45,50.8 | IC10.5 163.83,48.26 161.29,50.8 v161.29,91.44 | v55.88,50.8 v55.88,34.29
LATCH2  (via drill 0.6)
  Top 0.254: v41.91,114.3 47.62,114.3 48.26,114.94 55.24,114.94 57.15,116.84 81.92,116.84 v82.55,116.2 | v41.91,93.98 IC3.7 | v41.91,60.96 IC2.7 | IC4.7 25.4,80.01 26.67,81.28 34.29,81.28 35.56,82.55 v41.91,82.55 | v113.03,113.03 100.33,113.03 99.06,111.76 IC1.3 | v116.84,88.9 v160.02,88.9 160.02,87.63 163.83,83.82 IC8.7 | IC5.15 85.09,24.13 77.47,24.13 69.85,31.75 55.88,31.75 v54.61,33.02 | v54.61,49.53 v43.18,49.53
  Bottom 0.254: IC1.3 86.36,111.76 v82.55,116.2 | v41.91,114.3 v41.91,93.98 v41.91,82.55 v41.91,60.96 41.91,50.8 v43.18,49.53 | v113.03,113.03 113.03,100.33 116.84,96.52 v116.84,88.9 | IC10.6 163.83,45.72 160.02,49.53 v160.02,88.9 | v54.61,33.02 v54.61,49.53
LATCH3  (via drill 0.6)
  Top 0.254: v40.64,113.03 47.62,113.03 48.26,113.67 56.52,113.67 57.15,113.03 67.31,113.03 68.58,114.3 v81.92,114.3 | v40.64,90.17 44.45,90.17 45.72,91.44 IC3.8 | v40.64,58.42 IC2.8 | IC4.8 27.94,77.47 29.21,76.2 36.83,76.2 39.37,78.74 v40.64,78.74 | v111.76,110.49 99.06,110.49 97.79,109.22 IC1.4 | v115.57,86.36 157.48,86.36 v158.75,85.09 162.56,81.28 IC8.8 | v158.75,38.1 IC10.9 | IC5.17 101.6,19.05 100.33,20.32 86.36,20.32 83.82,22.86 77.47,22.86 69.85,30.48 54.61,30.48 v53.34,31.75 | v53.34,48.26 v41.91,48.26
  Bottom 0.254: IC1.4 86.36,109.22 v81.92,114.3 | v40.64,113.03 v40.64,90.17 v40.64,78.74 v40.64,58.42 40.64,49.53 v41.91,48.26 | v111.76,110.49 111.76,100.33 115.57,96.52 v115.57,86.36 | v158.75,85.09 v158.75,38.1 | v53.34,31.75 v53.34,48.26
LATCH4  (via drill 0.6)
  Top 0.254: v62.23,104.14 77.47,104.14 78.74,105.41 83.82,105.41 85.09,106.68 IC1.5 99.06,106.68 100.33,107.95 v110.49,107.95 | v60.96,91.44 IC3.13 | v60.96,58.42 IC2.13 | IC4.13 35.56,77.47 38.1,80.01 44.45,80.01 45.72,81.28 v60.96,81.28 | v111.76,87.63 158.12,87.63 163.19,82.55 171.45,82.55 IC8.13 v176.53,81.28 | v179.07,38.1 IC10.12
  Bottom 0.254: v62.23,104.14 60.96,102.87 v60.96,91.44 v60.96,81.28 v60.96,58.42 | v110.49,107.95 110.49,100.33 113.03,97.79 113.03,88.9 v111.76,87.63 111.76,80.01 110.49,78.74 110.49,27.94 104.14,21.59 IC5.18 | v176.53,81.28 176.53,66.04 177.8,64.77 177.8,50.8 179.07,49.53 v179.07,38.1
LATCH5/MOSI  (via drill 0.6)
  Top 0.254: v57.15,93.98 IC3.14 | v57.15,102.87 86.36,102.87 IC1.6 93.98,104.14 95.25,105.41 v109.22,105.41 | v57.15,60.96 IC2.14 | IC4.14 35.56,80.01 36.83,81.28 44.45,81.28 45.72,82.55 v57.15,82.55 | IC8.14 171.45,83.82 170.18,85.09 163.83,85.09 162.56,86.36 162.56,88.9 161.29,90.17 v111.76,90.17 | JP3.4 118.11,71.12 v109.22,71.12
  Bottom 0.254: v57.15,102.87 v57.15,93.98 v57.15,82.55 v57.15,60.96 | v109.22,105.41 109.22,100.33 111.76,97.79 v111.76,90.17 110.49,88.9 110.49,80.01 109.22,78.74 v109.22,71.12 109.22,29.21 104.14,24.13 IC5.19 | IC10.15 173.99,45.72 175.26,46.99 175.26,82.55 173.99,83.82 IC8.14
LATCH6/MISO  (via drill 0.6)
  Top 0.254: IC3.17 57.15,101.6 v58.42,100.33 86.36,100.33 IC1.7 90.17,101.6 91.44,102.87 v123.19,102.87 | IC2.17 v58.42,68.58 83.82,68.58 86.36,66.04 v99.06,66.04 | IC4.17 33.02,87.63 36.83,83.82 v58.42,83.82 | v123.19,95.25 v156.21,95.25 173.99,95.25 175.26,93.98 175.26,92.71 173.99,91.44 IC8.17 | IC10.16 170.18,48.26 168.91,49.53 v156.21,49.53 | v99.06,26.67 IC5.20 | v99.06,72.39 JP3.1
  Bottom 0.254: v58.42,68.58 v58.42,83.82 v58.42,100.33 | v123.19,95.25 v123.19,102.87 | v156.21,95.25 v156.21,49.53 | v99.06,26.67 v99.06,66.04 v99.06,72.39
LATCH7/SCK  (via drill 0.6)
  Top 0.254: v59.69,104.14 IC3.18 | IC2.18 v59.69,71.12 74.93,71.12 76.2,69.85 v107.95,69.85 JP3.3 118.11,68.58 v121.92,68.58 | IC4.18 35.56,90.17 40.64,85.09 v59.69,85.09 | IC8.18 171.45,93.98 170.18,92.71 v157.48,92.71 v120.65,92.71 | IC1.8 99.06,99.06 100.33,100.33 v117.47,100.33 | IC10.19 171.45,55.88 170.18,57.15 v157.48,57.15
  Bottom 0.254: v59.69,71.12 v59.69,85.09 v59.69,104.14 | v117.47,100.33 119.38,98.42 119.38,93.98 v120.65,92.71 120.65,69.85 v121.92,68.58 | v157.48,92.71 v157.48,57.15 | IC5.21 104.14,29.21 107.95,33.02 v107.95,69.85
LATCH_ENABLE0  (via drill 0.6)
  Top 0.254: v52.07,69.85 v69.85,69.85 | v69.85,113.03 82.55,113.03 85.09,115.57 88.9,115.57 90.17,116.84 v100.33,116.84
  Bottom 0.254: IC2.11 53.34,53.34 52.07,54.61 v52.07,69.85 | v69.85,69.85 v69.85,113.03 | v100.33,116.84 100.33,110.49 101.6,109.22 IC1.37
LATCH_ENABLE1  (via drill 0.6)
  Top 0.254: IC3.11 v67.31,86.36 | v67.31,111.76 83.82,111.76 85.09,113.03 v99.06,113.03
  Bottom 0.254: v67.31,86.36 v67.31,111.76 | v99.06,113.03 99.06,109.22 101.6,106.68 IC1.36
LATCH_ENABLE2  (via drill 0.6)
  Top 0.254: IC4.11 39.37,72.39 41.91,74.93 v68.58,74.93 | v68.58,110.49 v96.52,110.49 | v96.52,104.14 IC1.35
  Bottom 0.254: v68.58,74.93 v68.58,110.49 | v96.52,110.49 v96.52,104.14
LATCH_ENABLE3  (via drill 0.6)
  Top 0.254: IC8.11 171.45,74.93 163.83,74.93 162.56,76.2 162.56,80.01 160.02,82.55 v113.03,82.55 | IC1.21 v113.03,68.58
  Bottom 0.254: v113.03,68.58 v113.03,82.55
LATCH_ENABLE4  (via drill 0.6)
  Top 0.254: IC1.25 109.22,78.74 110.49,80.01 110.49,83.19 111.12,83.82 v154.94,83.82 | v154.94,58.42 IC10.1
  Bottom 0.254: v154.94,83.82 v154.94,58.42 | IC10.1 R8.1
LED0
  Top 0.254: IC8.2 166.37,96.52 167.64,97.79 173.99,97.79 R39.1
LED1
  Top 0.254: IC8.5 166.37,88.9 167.64,90.17 179.07,90.17 R40.1
LED2
  Top 0.254: R41.1 181.61,87.63 166.37,87.63 IC8.6
LED3
  Top 0.254: IC8.9 168.91,78.74 170.18,77.47 179.07,77.47 R42.1
LED4  (via drill 0.6)
  Top 0.254: v181.61,78.74 IC8.12
  Bottom 0.254: v181.61,78.74 181.61,73.66 182.88,72.39 182.88,67.31 184.15,66.04 184.15,59.69 R43.1
LED5  (via drill 0.6)
  Top 0.254: v180.34,86.36 IC8.15
  Bottom 0.254: R44.1 184.15,46.99 184.15,53.34 182.88,54.61 182.88,64.77 181.61,66.04 181.61,72.39 180.34,73.66 v180.34,86.36
LED6  (via drill 0.6)
  Top 0.254: IC8.16 v179.07,88.9
  Bottom 0.254: R45.1 184.15,33.02 182.88,34.29 182.88,52.07 181.61,53.34 181.61,64.77 180.34,66.04 180.34,72.39 179.07,73.66 v179.07,88.9
LED7
  Bottom 0.254: R46.1 186.69,25.4 181.61,30.48 181.61,52.07 180.34,53.34 180.34,64.77 179.07,66.04 179.07,72.39 177.8,73.66 177.8,95.25 176.53,96.52 IC8.19
MEM_CD  (via drill 0.6)
  Top 0.254: MEM1.2 83.82,104.14 85.09,105.41 v92.71,105.41 | v92.71,82.55 93.98,83.82 IC1.27
  Bottom 0.254: v92.71,82.55 v92.71,105.41
MEM_CS  (via drill 0.6)
  Top 0.254: MEM2.1 62.23,106.68 63.5,105.41 v71.12,105.41 | IC1.19 80.01,71.12 77.47,73.66 v71.12,73.66
  Bottom 0.254: v71.12,73.66 v71.12,105.41
MEM_SCK  (via drill 0.6)
  Top 0.254: MEM2.2 64.77,109.22 67.31,106.68 v73.66,106.68 | v73.66,76.2 76.2,76.2 78.74,73.66 IC1.18
  Bottom 0.254: v73.66,76.2 v73.66,106.68
MEM_SI  (via drill 0.6)
  Top 0.254: MEM2.3 64.77,111.76 67.31,109.22 v83.82,109.22
  Bottom 0.254: IC1.17 86.36,76.2 85.09,77.47 85.09,107.95 v83.82,109.22
MEM_SO  (via drill 0.6)
  Top 0.254: v77.47,78.74 IC1.16 | MEM2.4 66.04,114.3 67.31,115.57 v77.47,115.57
  Bottom 0.254: v77.47,78.74 v77.47,115.57
N$1
  Top 0.254: IC1.12 87.5,88.77 X1.2 83.06,88.9 C1.1
N$2
  Top 0.254: C2.1 82.55,83.82 X1.1 86.23,86.36 IC1.13
N$3
  Top 1.27: IC6.IN 13.97,111.76 C12.+ 12.7,107.95 D2.C
N$4  (via drill 0.6)
  Top 0.254: Q1.3 129.54,45.72 130.81,44.45 137.16,44.45 138.43,43.18 138.43,27.94 v139.7,26.67
  Bottom 0.254: v139.7,26.67 IC9.11
N$5
  Top 0.254: IC1.29 JP1.1
N$6
  Top 0.254: R56.2 VR7.P$3
N$7
  Top 0.254: R7.2 21.59,41.91 IC7.1 IC7.2
N$8
  Top 0.254: JP11.2 R5.1
N$9  (via drill 0.6)
  Top 0.254: OK1.3 138.43,106.68 v147.32,106.68 D1.A
  Bottom 0.254: v147.32,106.68 147.32,108.58 146.69,109.22 146.69,118.75 146.05,119.38 142.24,119.38 141.6,120.02 JP11.1
N$10  (via drill 0.6)
  Top 0.254: OK1.2 139.7,110.49 140.97,111.76 v147.96,111.76 149.86,113.67 D1.C
  Bottom 0.254: R5.2 147.96,117.47 v147.96,111.76
N$11
  Top 0.254: C16.2 IC9.6
N$12
  Top 0.254: R3.2 131.44,118.75 130.81,119.38 JP10.1
N$13
  Top 0.254: JP10.2 133.35,120.65 134.62,119.38 R1.1
N$14
  Top 0.254: R57.1 VR7.P$1
N$15
  Top 1.27: D2.A JP5.2
N$16
  Top 0.254: C16.1 IC9.7
N$17
  Top 0.254: R51.2 128.27,54.61 127.64,53.98 Q1.2
N$18
  Top 0.254: R64.2 D3.A C28.1
N$19
  Top 0.254: R58.2 VR6.P$3
N$20
  Top 0.254: R59.1 VR6.P$1
N$21
  Top 0.254: D3.C 137.16,77.47 R70.2 R71.2
N$22
  Top 0.254: Q1.1 R52.2 IC12.2
N$23
  Top 0.254: Q2.2 R71.1
N$24
  Top 0.254: R51.1 133.35,57.15 IC12.1
N$25
  Top 0.254: IC1.28 JP2.1
N$26
  Top 0.254: MOD.1 147.32,17.78 149.86,20.32 R63.1 149.86,22.86 C18.1 R54.2 R53.1
N$27  (via drill 0.6)
  Top 0.254: v41.91,12.7 41.91,5.08 arc-90 39.37,1.91 36.2,1.91 arc-90 VR2.P$2 | C19.+ 42.29,18.16 arc-90 v41.91,17.78
  Bottom 0.254: v41.91,12.7 v41.91,17.78
N$28
  Bottom 0.254: R55.2 125.73,109.22 118.11,116.84 CV.1
N$29
  Top 0.254: IC9.9 R63.2
N$34  (via drill 0.6)
  Top 0.254: v49.53,12.7 arc-90 50.8,11.43 VR4.P$2 | C22.+ 49.28,18.03 arc90 v49.53,17.78
  Bottom 0.254: v49.53,12.7 v49.53,17.78
N$35
  Top 0.254: ENC1.B 172.56,106.68 162.56,106.68 R61.1
  Bottom 0.254: R61.1 R11.1
N$36
  Top 0.254: R23.1 R22.1
  Bottom 0.254: R23.1 R21.2
N$37
  Top 0.254: ENC1.A 167.8,109.22 160.02,109.22 R10.1
  Bottom 0.254: R60.1 R10.1
N$38
  Top 0.254: C27.2 R66.1 IC12.6
N$39
  Top 0.254: R25.1 R24.1
  Bottom 0.254: R25.1 R23.2
N$40
  Top 0.254: R27.1 R26.1
  Bottom 0.254: R27.1 R25.2
N$41
  Top 0.254: R29.1 R28.1
  Bottom 0.254: R29.1 R27.2
N$42
  Top 0.254: R31.1 R30.1
  Bottom 0.254: R31.1 R29.2
N$43
  Top 0.254: R33.1 R32.1
  Bottom 0.254: R33.1 R31.2
N$44
  Top 0.254: R35.1 R34.1
  Bottom 0.254: R35.1 R33.2
N$45  (via drill 0.6)
  Top 0.254: R20.1 R21.1 | v7.62,48.26 v7.62,54.61
  Bottom 0.254: R20.1 13.34,100.97 12.7,101.6 7.62,101.6 6.35,100.33 6.35,64.77 7.62,63.5 v7.62,54.61 | IC7.10 27.94,30.48 26.67,31.75 26.67,47.62 26.04,48.26 v7.62,48.26
N$46  (via drill 0.6)
  Top 0.254: v11.43,43.18 29.21,43.18 30.48,41.91 IC7.14 34.29,40.64 35.56,39.37 35.56,29.84 37.47,27.94 37.47,16.51 63.5,16.51 arc-90 67.31,12.7 VR3.P$2
  Top 0.406: VR3.P$2 VR3.P$3
  Bottom 0.254: C17.+ 10.16,29.21 10.16,41.91 v11.43,43.18
N$47
  Top 0.406: R6.2 41.91,117.47 41.91,120.02 43.81,121.92 POWER.A
N$48  (via drill 0.6)
  Top 0.254: R67.2 R68.1 R69.1 | v151.76,45.72 144.78,45.72 IC12.5
  Bottom 0.254: v151.76,45.72 R67.2
N$50
  Top 0.254: IC7.3 R12.2 C13.2
N$51
  Top 0.254: R66.2 151.76,49.53 153.03,50.8 153.03,58.42 149.86,60.96 VR5.P$3 VR5.P$2 145.41,61.59 140.97,61.59 139.7,62.87 R65.1
N$55  (via drill 0.6)
  Top 0.254: 18.41,27.94 v15.24,31.11 | VR1.P$1 15.24,5.08 16.51,6.35 16.51,26.04 18.41,27.94 | 18.41,27.94 IC7.6
  Bottom 0.254: v15.24,31.11 15.24,40.01 R7.1
N$60
  Top 0.254: IC7.13 R15.1 R16.1 34.29,16.51 35.56,15.24 55.88,15.24 arc-77 59.05,12.7 59.05,6.35 arc90 61.59,3.81 VR3.P$1
N$68
  Top 0.406: R39.2 189.23,111.76 LED0.A
N$70
  Top 0.406: R40.2 189.23,99.06 LED1.A
N$71
  Top 0.406: R41.2 189.23,86.36 LED2.A
N$72
  Top 0.406: R42.2 189.23,73.66 LED3.A
N$73
  Top 0.406: R43.2 189.23,60.96 LED4.A
N$74
  Top 0.406: R44.2 189.23,48.26 LED5.A
N$75
  Top 0.406: R45.2 189.23,35.56 LED6.A
N$76
  Top 0.406: LED7.A R46.2
N$87
  Top 0.61: IC1.32 C3.1
OE
  Bottom 0.254: 105.41,111.76 IC1.38 | 105.41,111.76 R38.1 | IC5.24 104.14,36.83 105.41,38.1 105.41,111.76
RC  (via drill 0.6)
  Top 0.254: IC12.7 R69.2 | VR5.P$1 142.24,66.04 R65.2 139.7,67.31 140.34,67.94 140.34,69.22 139.7,69.85 139.7,74.3 140.34,74.93 v140.34,79.38
  Bottom 0.254: R69.2 147.32,55.24 147.32,60.96 VR5.P$1 | B1_CLK.3 127,113.03 130.81,109.22 130.81,88.9 v140.34,79.38
RESET  (via drill 0.6)
  Top 0.254: IC1.9 88.9,96.52 90.17,97.79 113.03,97.79 v114.3,96.52
  Bottom 0.254: R2.2 JP3.5 115.57,68.58 115.57,83.82 114.3,85.09 v114.3,96.52
RX0  (via drill 0.6)
  Top 0.254: OK1.6 143.51,107.95 142.24,109.22 134.62,109.22 133.35,110.49 R4.1 130.81,113.67 130.81,116.84 128.91,118.75 113.67,118.75 113.03,119.38 93.34,119.38 92.71,118.75 90.81,118.75 90.17,119.38 v88.9,119.38
  Bottom 0.254: IC1.14 88.9,83.82 90.17,85.09 90.17,118.11 v88.9,119.38
SW0  (via drill 0.6)
  Top 0.254: v154.94,53.34 IC10.3 | v152.4,20.32 v165.1,20.32 | v165.1,31.75 160.02,31.75 158.75,33.02 R17.1
  Bottom 0.254: S0.4 82.91,7.34 83.19,7.62 83.26,7.54 S0.3 83.54,7.34 85.09,8.89 149.86,8.89 151.13,10.16 151.13,13.97 152.4,15.24 v152.4,20.32 | v154.94,53.34 154.94,35.56 R17.1 | v165.1,20.32 v165.1,31.75
SW1  (via drill 0.6)
  Top 0.254: S1.3 98.5,6.91 100.97,4.45 149.86,4.45 150.5,5.08 150.5,10.79 151.13,11.43 v152.4,11.43 | S1.3 97.87,7.06 97.16,6.99 96.8,7.34 | 96.8,7.34 S1.3 | S1.4 96.8,7.34 | v157.48,50.8 IC10.4 | v163.83,30.48 R13.1 | v153.67,19.05 v163.83,19.05
  Bottom 0.254: v152.4,11.43 152.4,13.97 153.67,15.24 v153.67,19.05 | v157.48,50.8 157.48,36.2 160.02,33.66 160.02,31.75 158.75,30.48 R13.1 | v163.83,19.05 v163.83,30.48
SW2  (via drill 0.6)
  Top 0.254: v153.67,12.7 149.86,12.7 149.22,12.06 149.22,6.35 148.59,5.71 113.67,5.71 112.04,7.34 S2.3 111.2,7.06 111.12,6.99 110.77,7.34 S2.4 | v160.02,43.18 IC10.7 | v160.02,27.94 R36.1 | v154.94,22.86 v160.02,22.86
  Bottom 0.254: v153.67,12.7 153.67,13.97 154.94,15.24 v154.94,22.86 | v160.02,43.18 160.02,35.56 161.29,34.29 161.29,29.21 v160.02,27.94 v160.02,22.86
SW3  (via drill 0.6)
  Top 0.254: v155.57,4.45 v155.57,11.43 | R19.1 v162.56,25.4 | v162.56,40.64 IC10.8
  Bottom 0.254: v155.57,4.45 128.91,4.45 126.01,7.34 S3.3 125.17,7.06 125.09,6.99 124.74,7.34 S3.4 | v155.57,11.43 155.57,14.61 156.21,15.24 156.21,24.13 R19.1 | v162.56,25.4 v162.56,40.64
SW4  (via drill 0.6)
  Top 0.254: v156.84,5.71 v156.84,12.7 | R47.1 v173.99,17.78 v157.48,17.78
  Bottom 0.254: v156.84,12.7 156.84,13.34 157.48,13.97 v157.48,17.78 | v156.84,5.71 140.97,5.71 139.34,7.34 S4.3 139.14,7.06 139.06,6.99 138.71,7.34 S4.4 | v173.99,17.78 173.99,27.94 175.26,29.21 175.26,39.37 173.99,40.64 IC10.13
SW5  (via drill 0.6)
  Top 0.254: v175.26,20.32 R37.1 | v158.75,10.16 173.99,10.16 v175.26,11.43
  Bottom 0.254: S5.4 151.49,7.34 151.76,7.62 151.84,7.54 S5.3 153.31,7.34 153.67,7.62 156.21,7.62 v158.75,10.16 | IC10.14 173.99,43.18 176.53,40.64 176.53,27.94 175.26,26.67 v175.26,20.32 v175.26,11.43
SW6  (via drill 0.6)
  Top 0.254: v176.53,22.86 R50.1 | v176.53,50.8 IC10.17 | S6.4 166.65,7.34 167,6.99 167.08,7.06 S6.3 167.08,8.33 167.64,8.89 175.26,8.89 v176.53,10.16
  Bottom 0.254: v176.53,50.8 176.53,49.53 177.8,48.26 177.8,26.67 176.53,25.4 v176.53,22.86 v176.53,10.16
SW7  (via drill 0.6)
  Top 0.254: v179.07,53.34 IC10.18 | S7.4 180.62,7.34 180.97,6.99 181.05,7.06 S7.3 178.08,7.34 v177.8,7.62
  Bottom 0.254: v179.07,53.34 179.07,52.07 180.34,50.8 R48.1 179.07,25.4 177.8,24.13 v177.8,7.62
THRU
  Top 0.254: R15.2 39.37,35.56 39.37,22.86 arc90 40.01,22.23 C19.-
TO_PULSE  (via drill 0.6)
  Top 0.254: C28.2 134.62,64.77 129.54,64.77 128.27,66.04 128.27,74.93 v133.35,80.01
  Bottom 0.254: B1_CLK.2 124.46,114.3 129.54,109.22 129.54,88.9 133.35,85.09 v133.35,80.01
TX0  (via drill 0.6)
  Top 0.254: v91.44,120.02 113.67,120.02 114.3,119.38 129.54,119.38 132.08,116.84 132.72,116.84 R3.1
  Bottom 0.254: IC1.15 88.9,81.28 91.44,83.82 v91.44,120.02
V+  (via drill 0.6, 0.8)
  Top 0.254: 2.54,33.02 R9.2 | 54.61,124.46 R49.2 | 140.97,115.57 135.25,115.57 R4.2 | 140.97,115.57 v144.78,115.57 | 140.97,115.57 C5.1 | v170.18,33.02 161.29,33.02 160.02,34.29 156.21,34.29 R17.2 | v170.18,26.67 181.61,26.67 R48.2 | R58.1 125.73,34.29 123.19,31.75 123.19,24.13 125.73,21.59 R56.1 | R53.2 149.86,33.02 146.05,36.83 C20.1 | R8.2 168.91,64.77 170.18,63.5 C14.1 | 161.29,124.46 v161.29,122.56 | R11.2 R10.2 | R67.1 150.5,55.88 143.51,55.88 | R72.2 138.43,57.15 C23.1 | R2.1 118.11,62.23 95.25,62.23 C11.1
  Top 0.406: 52.07,124.46 v52.07,121.92 | 2.54,44.45 C21.1 | 40.64,124.46 R6.1
  Top 0.61: C6.1 IC1.10 90.17,93.98 91.44,95.25 v95.25,95.25 | C7.1 IC1.30 v95.25,91.44 | 29.21,102.87 C10.1 | C20.1 IC9.16 140.97,39.37 | v140.97,12.7 140.97,39.37 | 140.97,39.37 140.97,55.88 142.24,57.15 C23.1 143.51,55.88 IC12.8 | 104.78,124.46 103.5,123.19 102.23,123.19 100.97,124.46 | 95.25,124.46 v95.25,122.56 | 105.41,124.46 v105.41,122.56
  Top 0.813: 180.34,124.46 v180.34,121.92 | IC5.32 95.25,57.15 93.98,58.42 C11.1 | R1.2 136.4,124.33 136.53,124.46 | v139.7,122.56 139.7,124.46 | v38.1,121.92 35.56,121.92 C4.+ | 78.74,124.46 v78.74,122.56
  Top 1.27: 180.34,124.46 161.29,124.46 139.7,124.46 136.53,124.46 105.41,124.46 104.78,124.46 | 100.97,124.46 95.25,124.46 78.74,124.46 54.61,124.46 52.07,124.46 40.64,124.46 38.1,124.46 36.83,123.19 C4.+ 31.75,123.19 30.48,121.92 30.48,118.11 | 2.54,33.02 2.54,44.45 2.54,102.87 29.21,102.87 32.38,106.05 32.38,116.2 30.48,118.11 | IC6.OUT 26.67,107.95 27.94,107.95 30.48,110.49 30.48,118.11
  Bottom 0.254: C5.1 140.97,118.11 139.7,119.38 v139.7,122.56 | v144.78,115.57 OK1.8 | R17.2 R13.2 R36.2 R19.2 | R48.2 R50.2 R37.2 R47.2 | 170.18,58.42 170.18,35.56 | 170.18,35.56 v170.18,33.02 v170.18,26.67 | R38.2 109.22,116.84 105.41,120.65 v105.41,122.56 | 125.73,12.7 R56.1 | 170.18,35.56 IC10.11 | v161.29,122.56 R11.2 | JP3.2 118.11,71.12 118.11,64.77 R2.1
  Bottom 0.406: 52.07,109.22 C9.1 v52.07,121.92 | 52.07,109.22 C8.1 IC2.20 | 52.07,109.22 IC3.20 | C21.1 25.4,34.29 24.13,33.02 IC7.4
  Bottom 0.61: C10.1 IC4.20 | v95.25,122.56 v95.25,95.25 v95.25,91.44 95.25,62.23 C11.1 | C25.1 170.18,99.06 | 170.18,99.06 IC8.20 | 170.18,99.06 C14.1 170.18,58.42 IC10.20
  Bottom 0.813: v140.97,12.7 125.73,12.7 78.74,12.7 62.23,29.21 48.26,29.21 46.99,30.48 46.99,38.73 36.83,48.9 36.83,110.49 38.1,111.76 v38.1,121.92 | C25.1 172.72,101.6 180.34,109.22 v180.34,121.92 | MEM1.1 80.01,101.6 78.74,102.87 v78.74,122.56
VDD/2A
  Top 0.254: R9.1 R14.2 C15.+ R12.1 17.14,33.66 20.32,30.48 IC7.5 25.4,30.48 26.67,31.75 26.67,34.29 27.94,35.56 IC7.12
WE  (via drill 0.6)
  Top 0.254: v104.14,121.92 103.5,121.28 88.9,121.28 88.27,120.65 v76.2,120.65 55.88,120.65 R49.1 | IC5.29 101.6,49.53 100.33,50.8 v76.2,50.8
  Bottom 0.254: v76.2,50.8 v76.2,120.65 | IC1.39 104.14,114.3 105.41,115.57 105.41,118.11 104.14,119.38 v104.14,121.92

## Text on the board
Top: WTPA 2.0 | WTPA 2.0b | Bent/SS 2k11! | Narrat1ve.com | TMB 2k11
Bottom: ...and can I bring | my gat? | WTPA 2.0b | Narrat1ve.com | TMB 2k11
tPlace: 1
tValues: + | <--Power | + | (I've got) | 8-15V
200bmp: Bendable 8-bit Sampler | Bent / Solid Sound 2k11 | Limited Edition! Or: | "First Green | is Gold, Yo" | Narrat1ve.com
201bmp: ?